# Altium project Laser-Cueing.PrjPcb
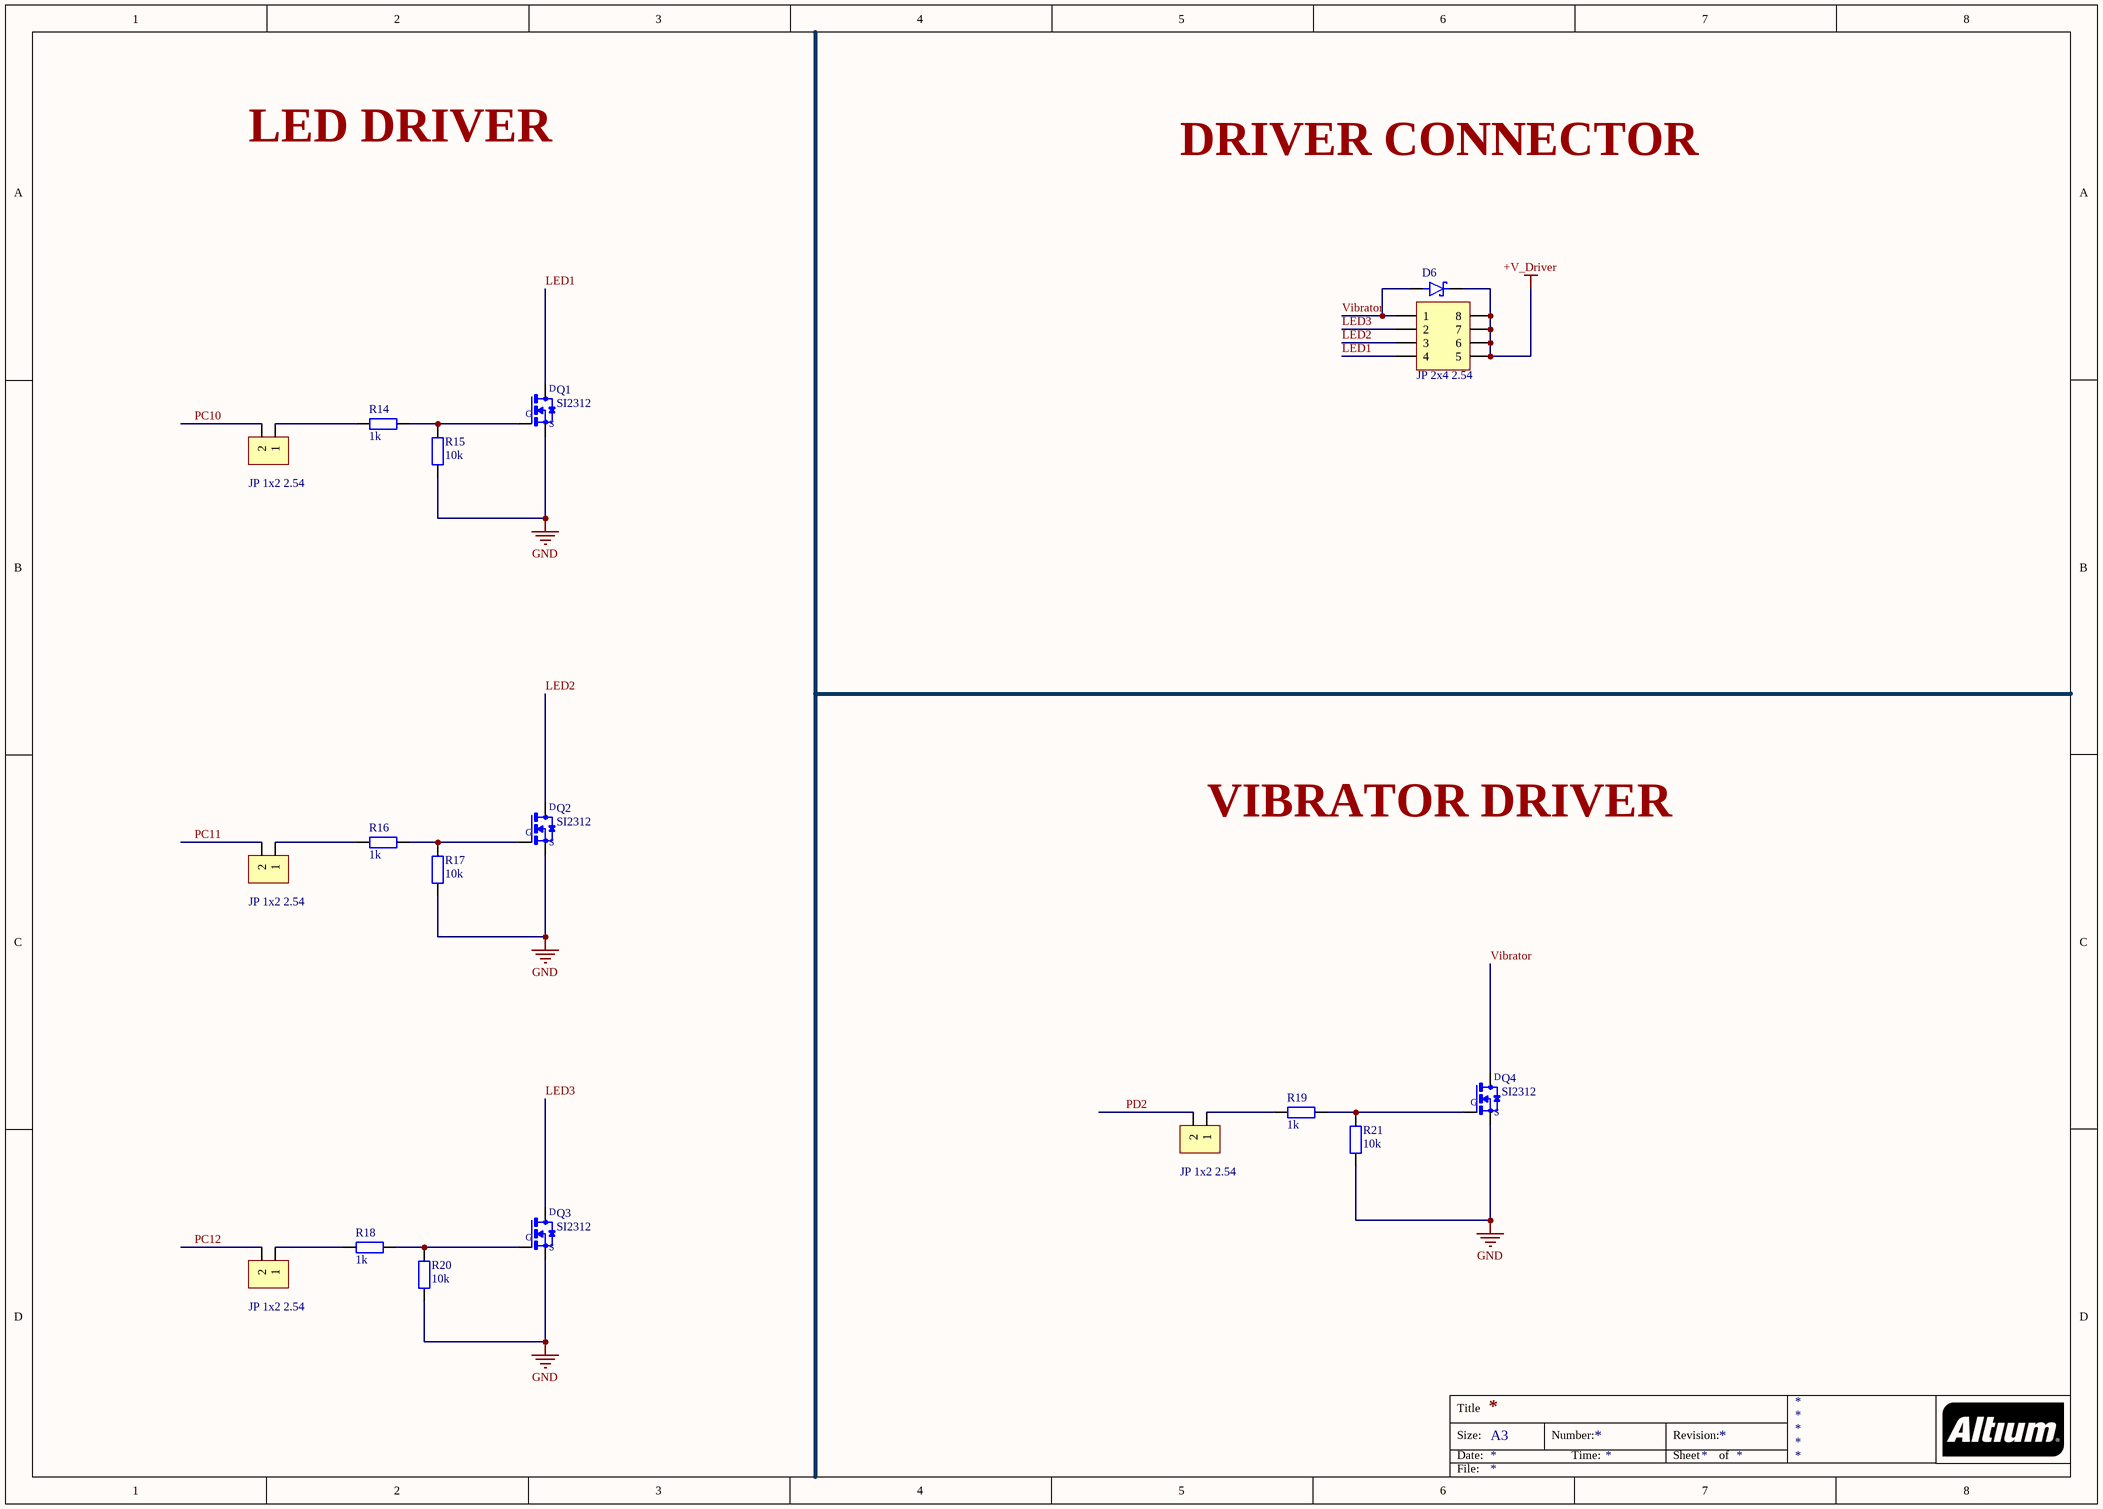
[diagram p0: Driver.SchDoc]
4 sheets, 89 parts. Net scope: global (net labels, ports and power ports of the same name join across sheets).
Board file: Cueing-PCB.PcbDoc
Sheets:
  Driver.SchDoc
  STM32_MCU.SchDoc
  ADC.SchDoc
  PWR_SRC.SchDoc

## Sheet Driver.SchDoc
size A3

### Parts
D6  1N5819HW-7-F  [SOD3715X145N]  (value not drawn)
Driver1  JP 2x4 2.54  [JP 2x4 DT]
JP2  JP 1x2 2.54  [JP 1x2 DT]
JP3  JP 1x2 2.54  [JP 1x2 DT]
JP4  JP 1x2 2.54  [JP 1x2 DT]
JP5  JP 1x2 2.54  [JP 1x2 DT]
Q1  SI2312  [SOT23]
Q2  SI2312  [SOT23]
Q3  SI2312  [SOT23]
Q4  SI2312  [SOT23]
R14  1k  [tro smd 0603]
R15  10k  [tro smd 0603]
R16  1k  [tro smd 0603]
R17  10k  [tro smd 0603]
R18  1k  [tro smd 0603]
R19  1k  [tro smd 0603]
R20  10k  [tro smd 0603]
R21  10k  [tro smd 0603]

### Nets
+V_Driver: D6.C(K) Driver1.5 Driver1.6 Driver1.7 Driver1.8
GND: Q1.2(S) Q2.2(S) Q3.2(S) Q4.2(S) R15.1 R17.1 R20.1 R21.1
LED1: Driver1.4 Q1.3(D)
LED2: Driver1.3 Q2.3(D)
LED3: Driver1.2 Q3.3(D)
PC10: JP2.2
PC11: JP3.2
PC12: JP4.2
PD2: JP5.2
Vibrator: D6.A Driver1.1 Q4.3(D)
NetJP2_1: JP2.1 R14.1
NetJP3_1: JP3.1 R16.1
NetJP4_1: JP4.1 R18.1
NetJP5_1: JP5.1 R19.1
NetQ1_1: Q1.1(G) R14.2 R15.2
NetQ2_1: Q2.1(G) R16.2 R17.2
NetQ3_1: Q3.1(G) R18.2 R20.2
NetQ4_1: Q4.1(G) R19.2 R21.2

### Notes on the sheet
- LED DRIVER
- DRIVER CONNECTOR
- VIBRATOR DRIVER
- Title
- Size:
- Date:
- A3
- Number:
- Time:
- Revision:
- Sheet
- of
- File:

### Library data of the parts
D6 = 1N5819HW-7-F: 1N5819HW Series 40 V 1 A Surface Mount Schottky Barrier Rectifier - SOD-123; MF: {'manufacturer': u'Diodes Inc.'}; Package: None; Price: None; Value: *; MP: 1N5819HW-7-F; Availability: Unavailable
Driver1 = JP 2x4 2.54 Duc Thang: Cắm; Ten_Linh_Kien: Jump Đôi Đực 2.54MM 2x40P Thẳng 11MM; Don_Vi: Con; Ma_Hang: MH002686; Ghi_Chu: *; Kieu_Chan: *; Chung_Loai: Cắm
JP2-JP5 = JP 1x2 2.54 Duc Thang: Cắm; Ten_Linh_Kien: Jump Đơn Đực 2.54MM 1x40P Thẳng 11MM; Don_Vi: Con; Ma_Hang: MH000903; Ghi_Chu: *; Kieu_Chan: *; Chung_Loai: Cắm
Q1-Q4 = SI2312: <b>N-Channel MOSFET</b>    <a href="https://pricing.snapeda.com/parts/SI2312/Micro%20Commercial%20Components/view-part?ref=eda">Check availability</a> <a href="https://pricing.snapeda.com/parts/SI2312/Micro%20Commercial%20Components/view-part?ref=eda">Check availability</a>; MF: {'manufacturer': u'Micro Commercial Components'}; MP: SI2312-TP; Package: None; Price: None; Value: *; Availability: Unavailable
R14 R16 R18 R19 = Tro 0603 1% 1k: Dán; So_Chan: 2; Don_Vi: Con; Ten_Linh_Kien: Trở 0603 1% 1k; Ma_Hang: MH006334; Chung_Loai: Dán; Kieu_Chan: *
R15 R17 R20 R21 = Tro 0603 1% 10k: Dán; Don_Vi: Con; So_Chan: 2; Ten_Linh_Kien: Trở 0603 1% 10k; Ma_Hang: MH006333; Chung_Loai: Dán; Kieu_Chan: *

## Sheet STM32_MCU.SchDoc
size A2
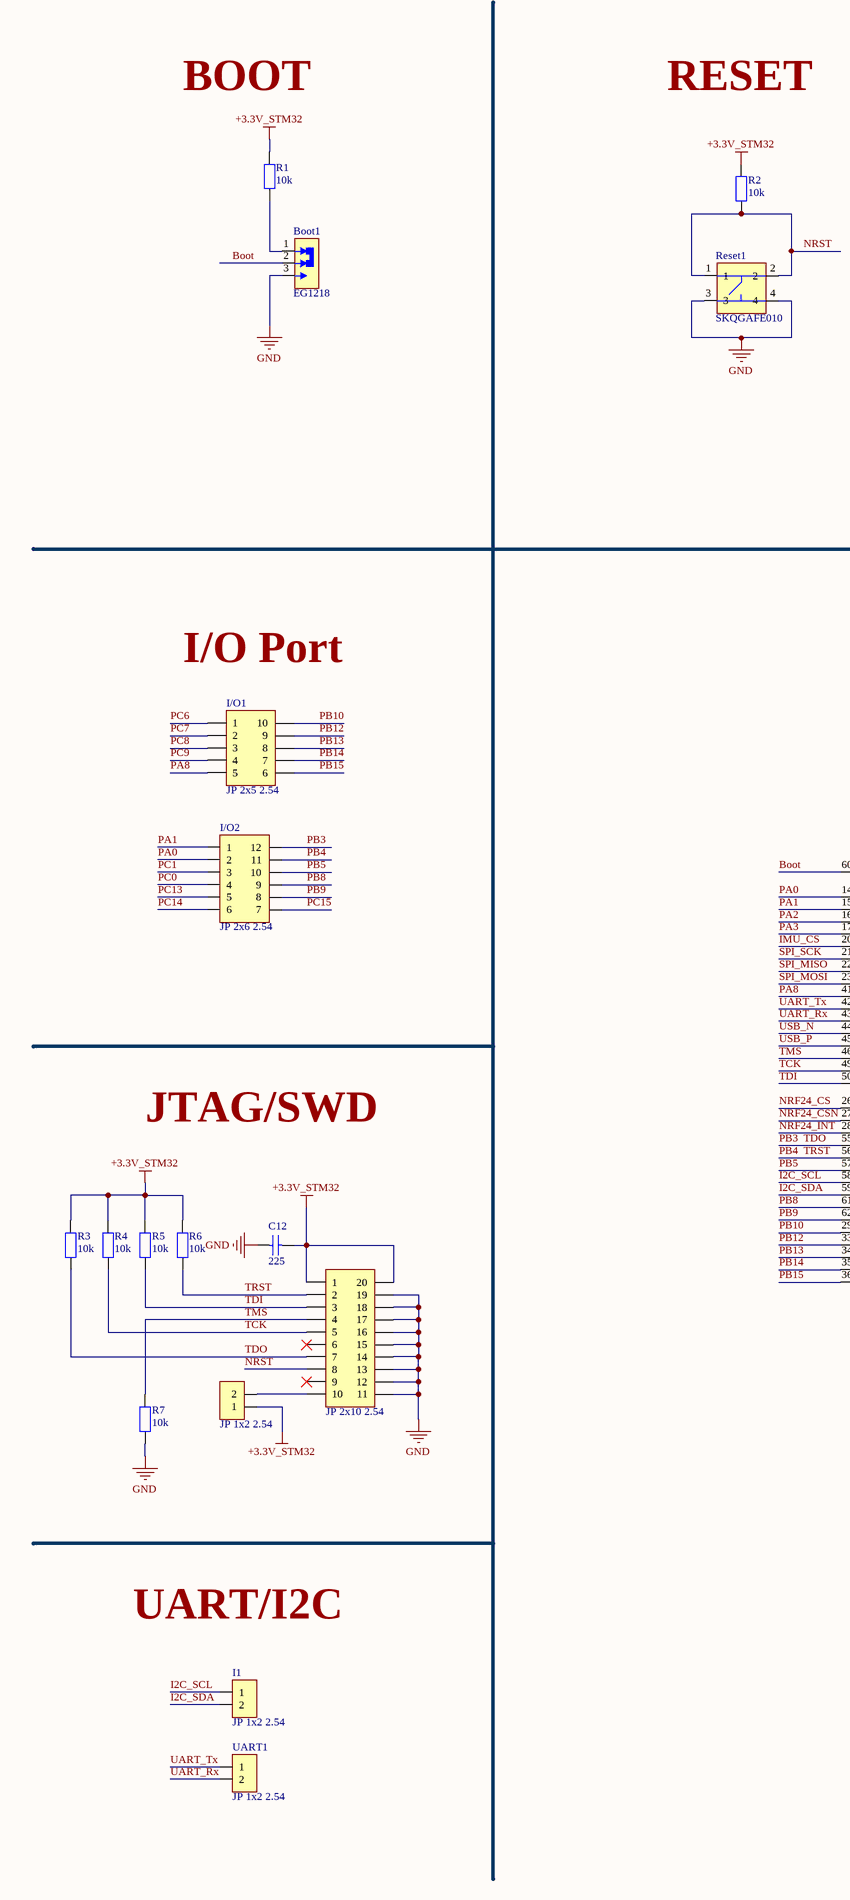
[diagram p1: STM32_MCU.SchDoc, left]
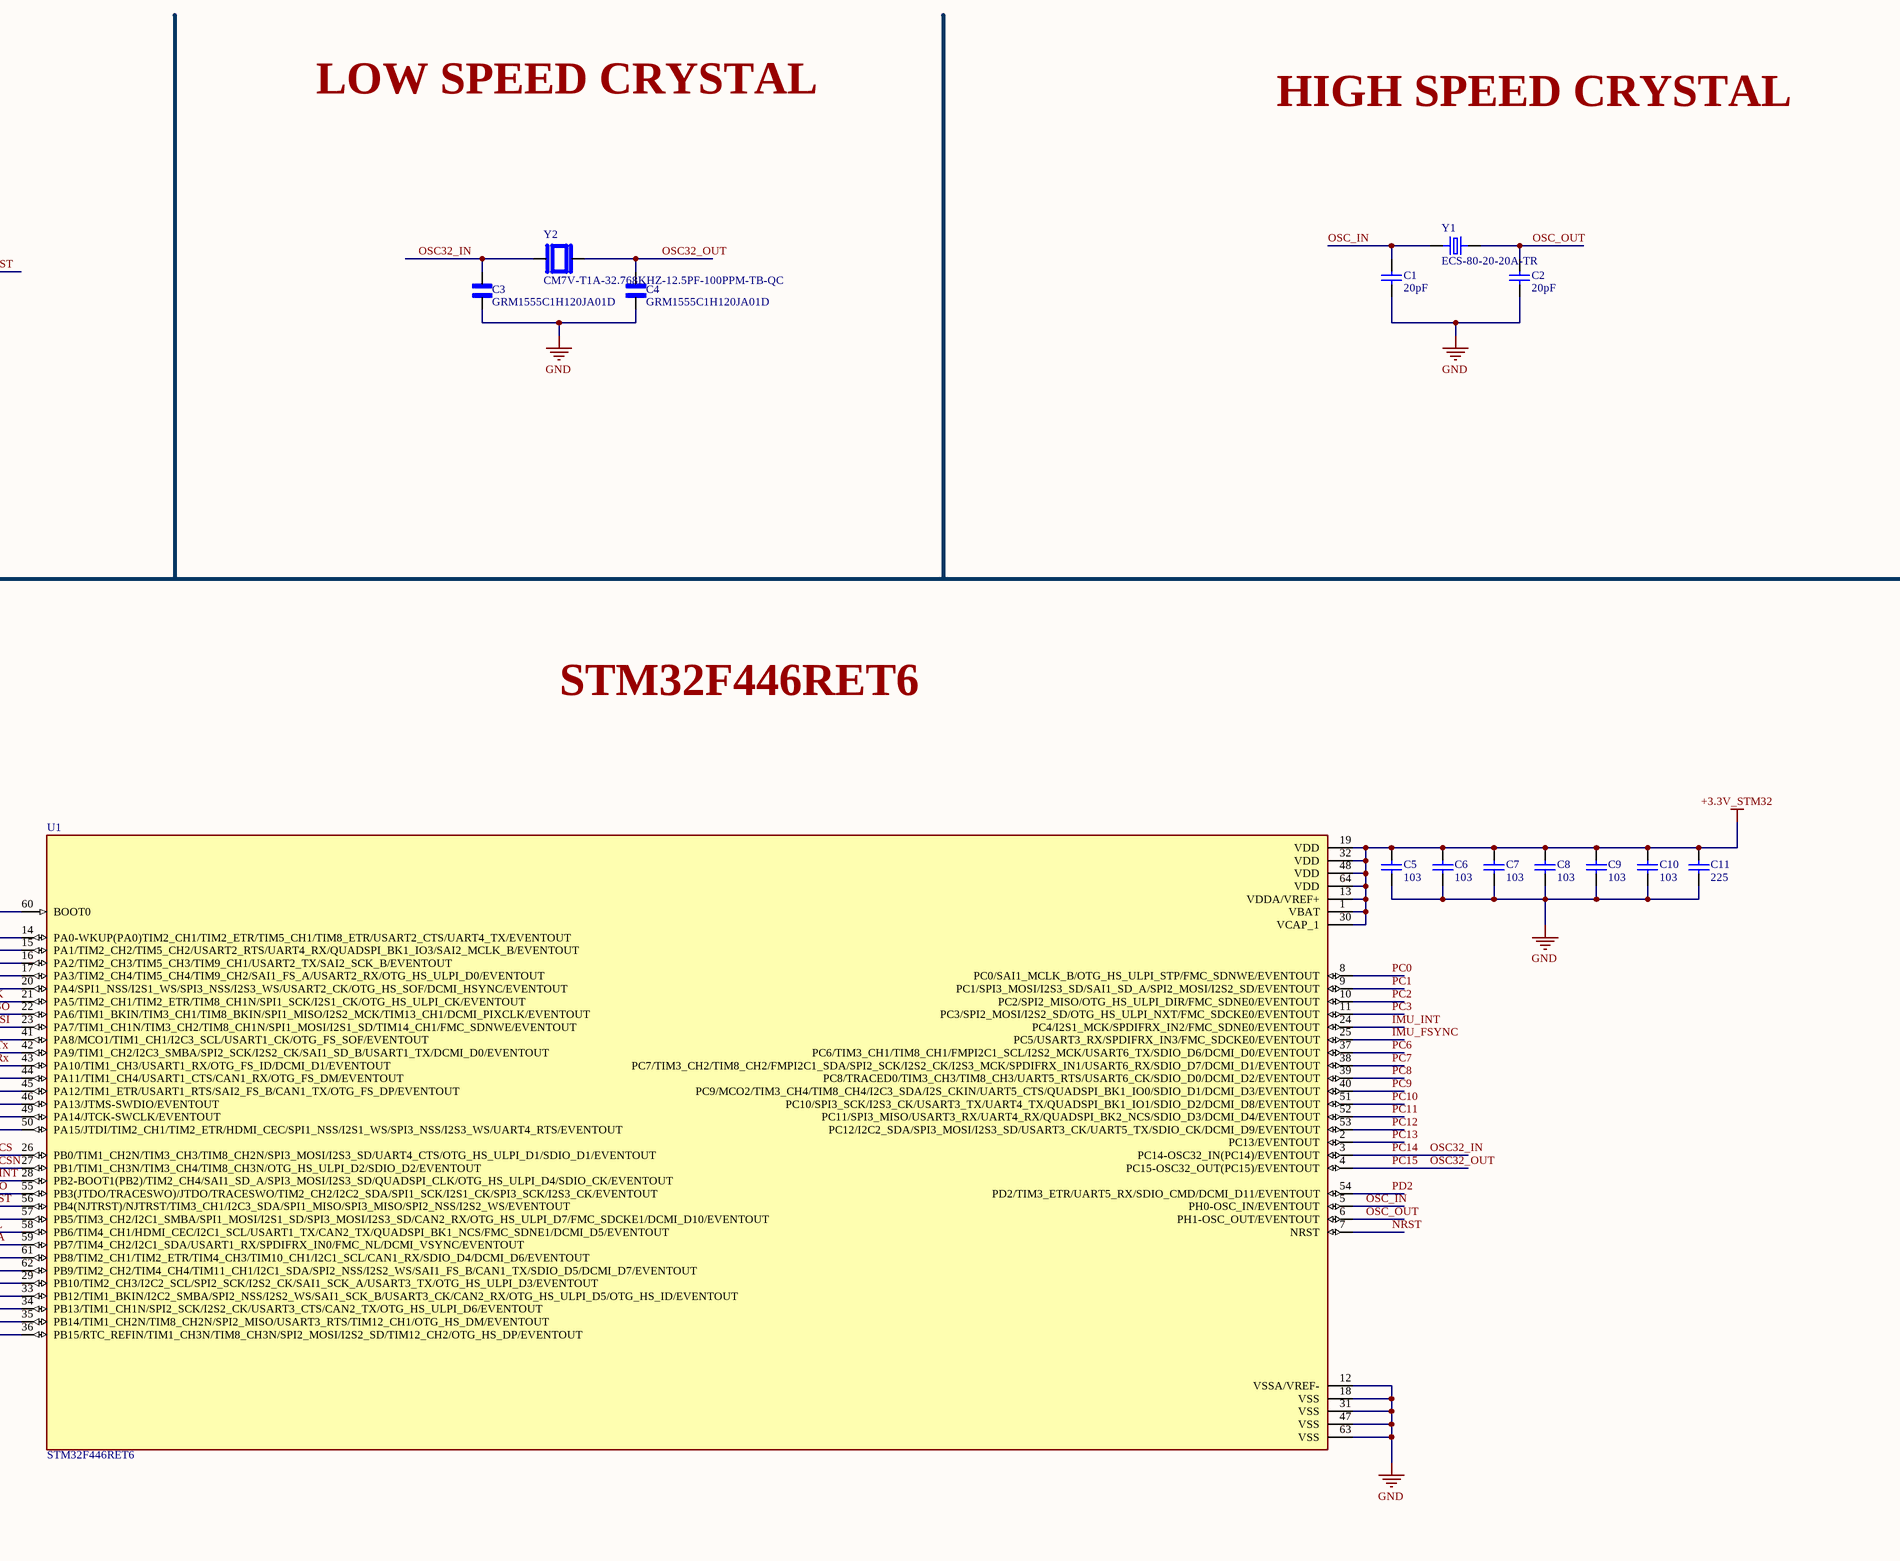
[diagram p2: STM32_MCU.SchDoc, right]

### Parts
Boot1  EG1218  [SW_EG1218]
C1  20pF  [tu 0805]
C2  20pF  [tu 0805]
C3  GRM1555C1H120JA01D  [CAPC1005X55N]
C4  GRM1555C1H120JA01D  [CAPC1005X55N]
C5  103  [tu 0603]
C6  103  [tu 0603]
C7  103  [tu 0603]
C8  103  [tu 0603]
C9  103  [tu 0603]
C10  103  [tu 0603]
C11  225  [tu 0805]
C12  225  [tu 0805]
I1  JP 1x2 2.54  [JP 1x2 DT]
I/O1  JP 2x5 2.54  [JP 2x5 DT]
I/O2  JP 2x6 2.54  [JP 2x6 DT]
JP1  JP 1x2 2.54  [JP 1x2 DT]
R1  10k  [tro smd 0603]
R2  10k  [tro smd 0603]
R3  10k  [tro smd 0603]
R4  10k  [tro smd 0603]
R5  10k  [tro smd 0603]
R6  10k  [tro smd 0603]
R7  10k  [tro smd 0603]
Reset1  SKQGAFE010  [SW_SKQGAFE010]
SWD/JTAG1  JP 2x10 2.54  [JP 2x10 DT]
U1  STM32F446RET6  [QFP50P1200X1200X160-64N]
UART1  JP 1x2 2.54  [JP 1x2 DT]
Y1  ECS-80-20-20A-TR  [XTAL_ECS-80-20-20A-TR]
Y2  CM7V-T1A-32.768KHZ-12.5PF-100PPM-TB-QC  [XTAL_CM7V-T1A-32.768KHZ-12.5PF-100PPM-TB-QC]

### Nets
+3.3V_STM32: C5.1 C6.1 C7.1 C8.1 C9.1 C10.1 C11.1 C12.1 JP1.1 R1.2 R2.2 R3.2 R4.2 R5.2 R6.2 SWD/JTAG1.1 SWD/JTAG1.20 U1.1(VBAT) U1.13(VDDA/VREF+) U1.19(VDD) U1.30(VCAP_1) U1.32(VDD) U1.48(VDD) U1.64(VDD)
GND: Boot1.3(NO) C1.2 C2.2 C3.1 C4.1 C5.2 C6.2 C7.2 C8.2 C9.2 C10.2 C11.2 C12.2 R7.1 Reset1.3 Reset1.4 SWD/JTAG1.11 SWD/JTAG1.12 SWD/JTAG1.13 SWD/JTAG1.14 SWD/JTAG1.15 SWD/JTAG1.16 SWD/JTAG1.17 SWD/JTAG1.18 SWD/JTAG1.19 U1.12(VSSA/VREF-) U1.18(VSS) U1.31(VSS) U1.47(VSS) U1.63(VSS)
Boot: Boot1.2(COM) U1.60(BOOT0)
I2C_SCL: I1.1 U1.58(PB6/TIM4_CH1/HDMI_CEC/I2C1_SCL/USART1_TX/CAN2_TX/QUADSPI_BK1_NCS/FMC_SDNE1/DCMI_D5/EVENTOUT)
I2C_SDA: I1.2 U1.59(PB7/TIM4_CH2/I2C1_SDA/USART1_RX/SPDIFRX_IN0/FMC_NL/DCMI_VSYNC/EVENTOUT)
IMU_CS: U1.20(PA4/SPI1_NSS/I2S1_WS/SPI3_NSS/I2S3_WS/USART2_CK/OTG_HS_SOF/DCMI_HSYNC/EVENTOUT)
IMU_FSYNC: U1.25(PC5/USART3_RX/SPDIFRX_IN3/FMC_SDCKE0/EVENTOUT)
IMU_INT: U1.24(PC4/I2S1_MCK/SPDIFRX_IN2/FMC_SDNE0/EVENTOUT)
NRF24_CS: U1.26(PB0/TIM1_CH2N/TIM3_CH3/TIM8_CH2N/SPI3_MOSI/I2S3_SD/UART4_CTS/OTG_HS_ULPI_D1/SDIO_D1/EVENTOUT)
NRF24_CSN: U1.27(PB1/TIM1_CH3N/TIM3_CH4/TIM8_CH3N/OTG_HS_ULPI_D2/SDIO_D2/EVENTOUT)
NRF24_INT: U1.28(PB2-BOOT1(PB2)/TIM2_CH4/SAI1_SD_A/SPI3_MOSI/I2S3_SD/QUADSPI_CLK/OTG_HS_ULPI_D4/SDIO_CK/EVENTOUT)
NRST: R2.1 Reset1.1 Reset1.2 SWD/JTAG1.8 U1.7(NRST)
OSC32_IN: C3.2 I/O2.6 U1.3(PC14-OSC32_IN(PC14)/EVENTOUT) Y2.1  [also labelled PC14]
OSC32_OUT: C4.2 I/O2.7 U1.4(PC15-OSC32_OUT(PC15)/EVENTOUT) Y2.2  [also labelled PC15]
OSC_IN: C1.1 U1.5(PH0-OSC_IN/EVENTOUT) Y1.1
OSC_OUT: C2.1 U1.6(PH1-OSC_OUT/EVENTOUT) Y1.2
PA0: I/O2.2 U1.14(PA0-WKUP(PA0)TIM2_CH1/TIM2_ETR/TIM5_CH1/TIM8_ETR/USART2_CTS/UART4_TX/EVENTOUT)
PA1: I/O2.1 U1.15(PA1/TIM2_CH2/TIM5_CH2/USART2_RTS/UART4_RX/QUADSPI_BK1_IO3/SAI2_MCLK_B/EVENTOUT)
PA2: U1.16(PA2/TIM2_CH3/TIM5_CH3/TIM9_CH1/USART2_TX/SAI2_SCK_B/EVENTOUT)
PA3: U1.17(PA3/TIM2_CH4/TIM5_CH4/TIM9_CH2/SAI1_FS_A/USART2_RX/OTG_HS_ULPI_D0/EVENTOUT)
PA8: I/O1.5 U1.41(PA8/MCO1/TIM1_CH1/I2C3_SCL/USART1_CK/OTG_FS_SOF/EVENTOUT)
PB3: I/O2.12 R3.1 SWD/JTAG1.7 U1.55(PB3(JTDO/TRACESWO)/JTDO/TRACESWO/TIM2_CH2/I2C2_SDA/SPI1_SCK/I2S1_CK/SPI3_SCK/I2S3_CK/EVENTOUT)  [also labelled TDO]
PB4: I/O2.11 R6.1 SWD/JTAG1.2 U1.56(PB4(NJTRST)/NJTRST/TIM3_CH1/I2C3_SDA/SPI1_MISO/SPI3_MISO/SPI2_NSS/I2S2_WS/EVENTOUT)  [also labelled TRST]
PB5: I/O2.10 U1.57(PB5/TIM3_CH2/I2C1_SMBA/SPI1_MOSI/I2S1_SD/SPI3_MOSI/I2S3_SD/CAN2_RX/OTG_HS_ULPI_D7/FMC_SDCKE1/DCMI_D10/EVENTOUT)
PB8: I/O2.9 U1.61(PB8/TIM2_CH1/TIM2_ETR/TIM4_CH3/TIM10_CH1/I2C1_SCL/CAN1_RX/SDIO_D4/DCMI_D6/EVENTOUT)
PB9: I/O2.8 U1.62(PB9/TIM2_CH2/TIM4_CH4/TIM11_CH1/I2C1_SDA/SPI2_NSS/I2S2_WS/SAI1_FS_B/CAN1_TX/SDIO_D5/DCMI_D7/EVENTOUT)
PB10: I/O1.10 U1.29(PB10/TIM2_CH3/I2C2_SCL/SPI2_SCK/I2S2_CK/SAI1_SCK_A/USART3_TX/OTG_HS_ULPI_D3/EVENTOUT)
PB12: I/O1.9 U1.33(PB12/TIM1_BKIN/I2C2_SMBA/SPI2_NSS/I2S2_WS/SAI1_SCK_B/USART3_CK/CAN2_RX/OTG_HS_ULPI_D5/OTG_HS_ID/EVENTOUT)
PB13: I/O1.8 U1.34(PB13/TIM1_CH1N/SPI2_SCK/I2S2_CK/USART3_CTS/CAN2_TX/OTG_HS_ULPI_D6/EVENTOUT)
PB14: I/O1.7 U1.35(PB14/TIM1_CH2N/TIM8_CH2N/SPI2_MISO/USART3_RTS/TIM12_CH1/OTG_HS_DM/EVENTOUT)
PB15: I/O1.6 U1.36(PB15/RTC_REFIN/TIM1_CH3N/TIM8_CH3N/SPI2_MOSI/I2S2_SD/TIM12_CH2/OTG_HS_DP/EVENTOUT)
PC0: I/O2.4 U1.8(PC0/SAI1_MCLK_B/OTG_HS_ULPI_STP/FMC_SDNWE/EVENTOUT)
PC1: I/O2.3 U1.9(PC1/SPI3_MOSI/I2S3_SD/SAI1_SD_A/SPI2_MOSI/I2S2_SD/EVENTOUT)
PC2: U1.10(PC2/SPI2_MISO/OTG_HS_ULPI_DIR/FMC_SDNE0/EVENTOUT)
PC3: U1.11(PC3/SPI2_MOSI/I2S2_SD/OTG_HS_ULPI_NXT/FMC_SDCKE0/EVENTOUT)
PC6: I/O1.1 U1.37(PC6/TIM3_CH1/TIM8_CH1/FMPI2C1_SCL/I2S2_MCK/USART6_TX/SDIO_D6/DCMI_D0/EVENTOUT)
PC7: I/O1.2 U1.38(PC7/TIM3_CH2/TIM8_CH2/FMPI2C1_SDA/SPI2_SCK/I2S2_CK/I2S3_MCK/SPDIFRX_IN1/USART6_RX/SDIO_D7/DCMI_D1/EVENTOUT)
PC8: I/O1.3 U1.39(PC8/TRACED0/TIM3_CH3/TIM8_CH3/UART5_RTS/USART6_CK/SDIO_D0/DCMI_D2/EVENTOUT)
PC9: I/O1.4 U1.40(PC9/MCO2/TIM3_CH4/TIM8_CH4/I2C3_SDA/I2S_CKIN/UART5_CTS/QUADSPI_BK1_IO0/SDIO_D1/DCMI_D3/EVENTOUT)
PC10: U1.51(PC10/SPI3_SCK/I2S3_CK/USART3_TX/UART4_TX/QUADSPI_BK1_IO1/SDIO_D2/DCMI_D8/EVENTOUT)
PC11: U1.52(PC11/SPI3_MISO/USART3_RX/UART4_RX/QUADSPI_BK2_NCS/SDIO_D3/DCMI_D4/EVENTOUT)
PC12: U1.53(PC12/I2C2_SDA/SPI3_MOSI/I2S3_SD/USART3_CK/UART5_TX/SDIO_CK/DCMI_D9/EVENTOUT)
PC13: I/O2.5 U1.2(PC13/EVENTOUT)
PD2: U1.54(PD2/TIM3_ETR/UART5_RX/SDIO_CMD/DCMI_D11/EVENTOUT)
SPI_MISO: U1.22(PA6/TIM1_BKIN/TIM3_CH1/TIM8_BKIN/SPI1_MISO/I2S2_MCK/TIM13_CH1/DCMI_PIXCLK/EVENTOUT)
SPI_MOSI: U1.23(PA7/TIM1_CH1N/TIM3_CH2/TIM8_CH1N/SPI1_MOSI/I2S1_SD/TIM14_CH1/FMC_SDNWE/EVENTOUT)
SPI_SCK: U1.21(PA5/TIM2_CH1/TIM2_ETR/TIM8_CH1N/SPI1_SCK/I2S1_CK/OTG_HS_ULPI_CK/EVENTOUT)
TCK: R4.1 SWD/JTAG1.5 U1.49(PA14/JTCK-SWCLK/EVENTOUT)
TDI: R5.1 SWD/JTAG1.3 U1.50(PA15/JTDI/TIM2_CH1/TIM2_ETR/HDMI_CEC/SPI1_NSS/I2S1_WS/SPI3_NSS/I2S3_WS/UART4_RTS/EVENTOUT)
TMS: R7.2 SWD/JTAG1.4 U1.46(PA13/JTMS-SWDIO/EVENTOUT)
UART_Rx: U1.43(PA10/TIM1_CH3/USART1_RX/OTG_FS_ID/DCMI_D1/EVENTOUT) UART1.2
UART_Tx: U1.42(PA9/TIM1_CH2/I2C3_SMBA/SPI2_SCK/I2S2_CK/SAI1_SD_B/USART1_TX/DCMI_D0/EVENTOUT) UART1.1
USB_N: U1.44(PA11/TIM1_CH4/USART1_CTS/CAN1_RX/OTG_FS_DM/EVENTOUT)
USB_P: U1.45(PA12/TIM1_ETR/USART1_RTS/SAI2_FS_B/CAN1_TX/OTG_FS_DP/EVENTOUT)
NetBoot1_1: Boot1.1(NC) R1.1
NetJP1_2: JP1.2 SWD/JTAG1.10

Not connected (* = marked no-connect by the designer): SWD/JTAG1 6* 9*

### Notes on the sheet
- BOOT
- RESET
- LOW SPEED CRYSTAL
- HIGH SPEED CRYSTAL
- I/O Port
- STM32F446RET6
- JTAG/SWD
- UART/I2C
- Title
- Size:
- Date:
- File:
- A2
- Number:
- Time:
- Revision:
- Sheet
- of

### Library data of the parts
Boot1 = EG1218: Slide Switch, EG Series, SPDT, Non-Shorting, ON-ON, 200mA DC, 30VDC, PC Pin | E-Switch EG1218; SnapEDA_Link: https://www.snapeda.com/parts/EG1218/E-Switch/view-part/?ref=snap; Package: None; Value: *; MF: E-Switch; MP: EG1218; Check_prices: https://www.snapeda.com/parts/EG1218/E-Switch/view-part/?ref=eda
C1 C2 = Tu 0805 20pF 50V 10%: Dán; Don_Vi: Con; Ten_Linh_Kien: Tụ 0805 20P 10% 50V; So_Chan: 2; Ma_Hang: MH004558; Chung_Loai: Dán; Kieu_Chan: *
C3 C4 = GRM1555C1H120JA01D: 0402 12 pF 50 V Â±5% Tolerance C0G SMT Multilayer Ceramic Capacitor; MF: {'manufacturer': u'Murata'}; Package: None; Price: None; Value: *; MP: GRM1555C1H120JA01D; Availability: Unavailable
C5-C10 = Tu 0603 103 50V 10%: Dán; Don_Vi: Con; So_Chan: 2; Ten_Linh_Kien: Tụ 0603 103-10nF 10% 50V; Ma_Hang: MH004567; Chung_Loai: Dán; Kieu_Chan: *
C11 C12 = Tu 0805 225 25V 10%: Dán; Don_Vi: Con; So_Chan: 2; Ten_Linh_Kien: Tụ 0805 225-2.2uF 25V 10%; Ma_Hang: MH007483; Chung_Loai: Dán; Kieu_Chan: *
I1 JP1 UART1 = JP 1x2 2.54 Duc Thang: as JP2 on sheet Driver; Ghi_Chu: *; Kieu_Chan: *; Chung_Loai: Cắm
I/O1 = JP 2x5 2.54 Duc Thang: Cắm; Ten_Linh_Kien: Jump Đôi Đực 2.54MM 2x40P Thẳng 11MM; Don_Vi: Con; Ma_Hang: MH002686; Ghi_Chu: *; Kieu_Chan: *; Chung_Loai: Cắm
I/O2 = JP 2x6 2.54 Duc Thang: Cắm; Ten_Linh_Kien: Jump Đôi Đực 2.54MM 2x40P Thẳng 11MM; Don_Vi: Con; Ma_Hang: MH002686; Ghi_Chu: *; Kieu_Chan: *; Chung_Loai: Cắm
R1-R7 = Tro 0603 1% 10k: as R15 on sheet Driver; Chung_Loai: Dán; Kieu_Chan: *
Reset1 = SKQGAFE010: Switch Tactile N.O. SPST Button Gull Wing 0.05A 12VDC 0.98N SMD T/R; MF: {'manufacturer': u'ALPS'}; Package: None; Price: None; Value: *; MP: SKQGAFE010; Availability: Unavailable
SWD/JTAG1 = JP 2x10 2.54 Duc Thang: Cắm; Ten_Linh_Kien: Jump Đôi Đực 2.54MM 2x40P Thẳng 11MM; Don_Vi: Con; Ma_Hang: MH002686; Ghi_Chu: *; Kieu_Chan: *; Chung_Loai: Cắm
U1 = STM32F446RET6: MCU 32-Bit STM32 ARM Cortex M4 RISC 512KB Flash 2.5V/3.3V 64-Pin LQFP Tray; MF: {'manufacturer': u'STMicroelectronics'}; Package: None; Price: None; Value: *; MP: STM32F446RET6; Availability: Unavailable
Y1 = ECS-80-20-20A-TR: SMD CRYSTAL; MF: {'manufacturer': u'ECS Inc.'}; Package: None; Price: None; Value: *; MP: ECS-80-20-20A-TR; Availability: Unavailable
Y2 = CM7V-T1A-32.768KHZ-12.5PF-100PPM-TB-QC: MF: {'manufacturer': u'Micro Crystal'}; Package: None; Price: None; Value: *; MP: CM7V-T1A-32.768KHZ-12.5PF-100PPM-TB-QC; Availability: Unavailable

## Sheet ADC.SchDoc
size A4
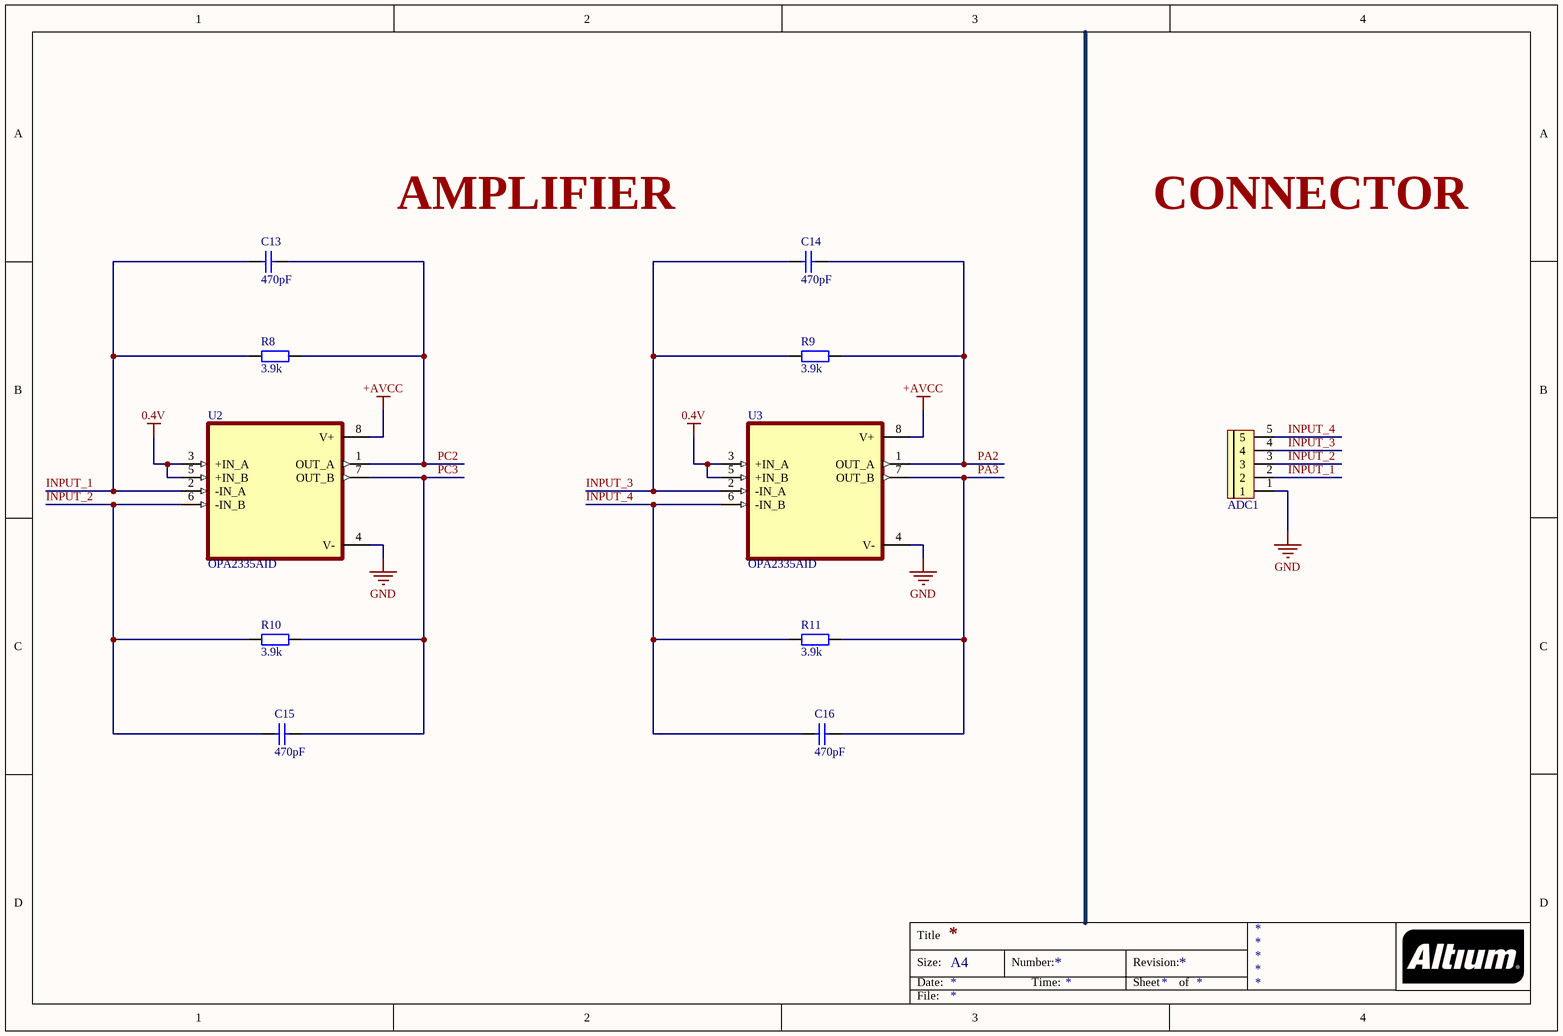
[diagram p3: ADC.SchDoc]

### Parts
ADC1  CON 5 EDG5.08  [CON 5 5EDG5.08]  (value not drawn)
C13  470pF  [tu 0603]
C14  470pF  [tu 0603]
C15  470pF  [tu 0603]
C16  470pF  [tu 0603]
R8  3.9k  [tro smd 0603]
R9  3.9k  [tro smd 0603]
R10  3.9k  [tro smd 0603]
R11  3.9k  [tro smd 0603]
U2  OPA2335AID  [SOIC127P599X175-8N]
U3  OPA2335AID  [SOIC127P599X175-8N]

### Nets
0.4V: U2.3(+IN_A) U2.5(+IN_B) U3.3(+IN_A) U3.5(+IN_B)
+AVCC: U2.8(V+) U3.8(V+)
GND: ADC1.1 U2.4(V-) U3.4(V-)
INPUT_1: ADC1.2 C13.2 R8.1 U2.2(-IN_A)
INPUT_2: ADC1.3 C15.2 R10.1 U2.6(-IN_B)
INPUT_3: ADC1.4 C14.2 R9.1 U3.2(-IN_A)
INPUT_4: ADC1.5 C16.2 R11.1 U3.6(-IN_B)
PA2: C14.1 R9.2 U3.1(OUT_A)
PA3: C16.1 R11.2 U3.7(OUT_B)
PC2: C13.1 R8.2 U2.1(OUT_A)
PC3: C15.1 R10.2 U2.7(OUT_B)

### Notes on the sheet
- AMPLIFIER
- CONNECTOR
- Title
- Size:
- Date:
- A4
- Number:
- Time:
- Revision:
- Sheet
- of
- File:

### Library data of the parts
ADC1 = CON 5 EDG5.08: Cắm; Ten_Linh_Kien: CON 5 2EDG5.08-5P 5.08MM ( Xanh Cong); Ma_Hang: MH003589; Kieu_Chan: *; Don_Vi: Con; Ghi_Chu: *; Chung_Loai: Cắm
C13-C16 = Tu 0603 470pF 50V 10%: Dán; Don_Vi: Con; So_Chan: 2; Ten_Linh_Kien: Tụ 0603 470P 50V 10%; Ma_Hang: MH004571; Chung_Loai: Dán; Kieu_Chan: *
R8-R11 = Tro 0603 1% 3.9k: Dán; So_Chan: 2; Ten_Linh_Kien: Trở 0603 1% 3.9k; Ma_Hang: MH005793; Don_Vi: Con; Chung_Loai: Dán; Kieu_Chan: *
U2 U3 = OPA2335AID: MF: {'manufacturer': u'Texas Instruments'}; Package: None; Price: None; Value: *; MP: OPA2335AID; Availability: Unavailable

## Sheet PWR_SRC.SchDoc
size A3
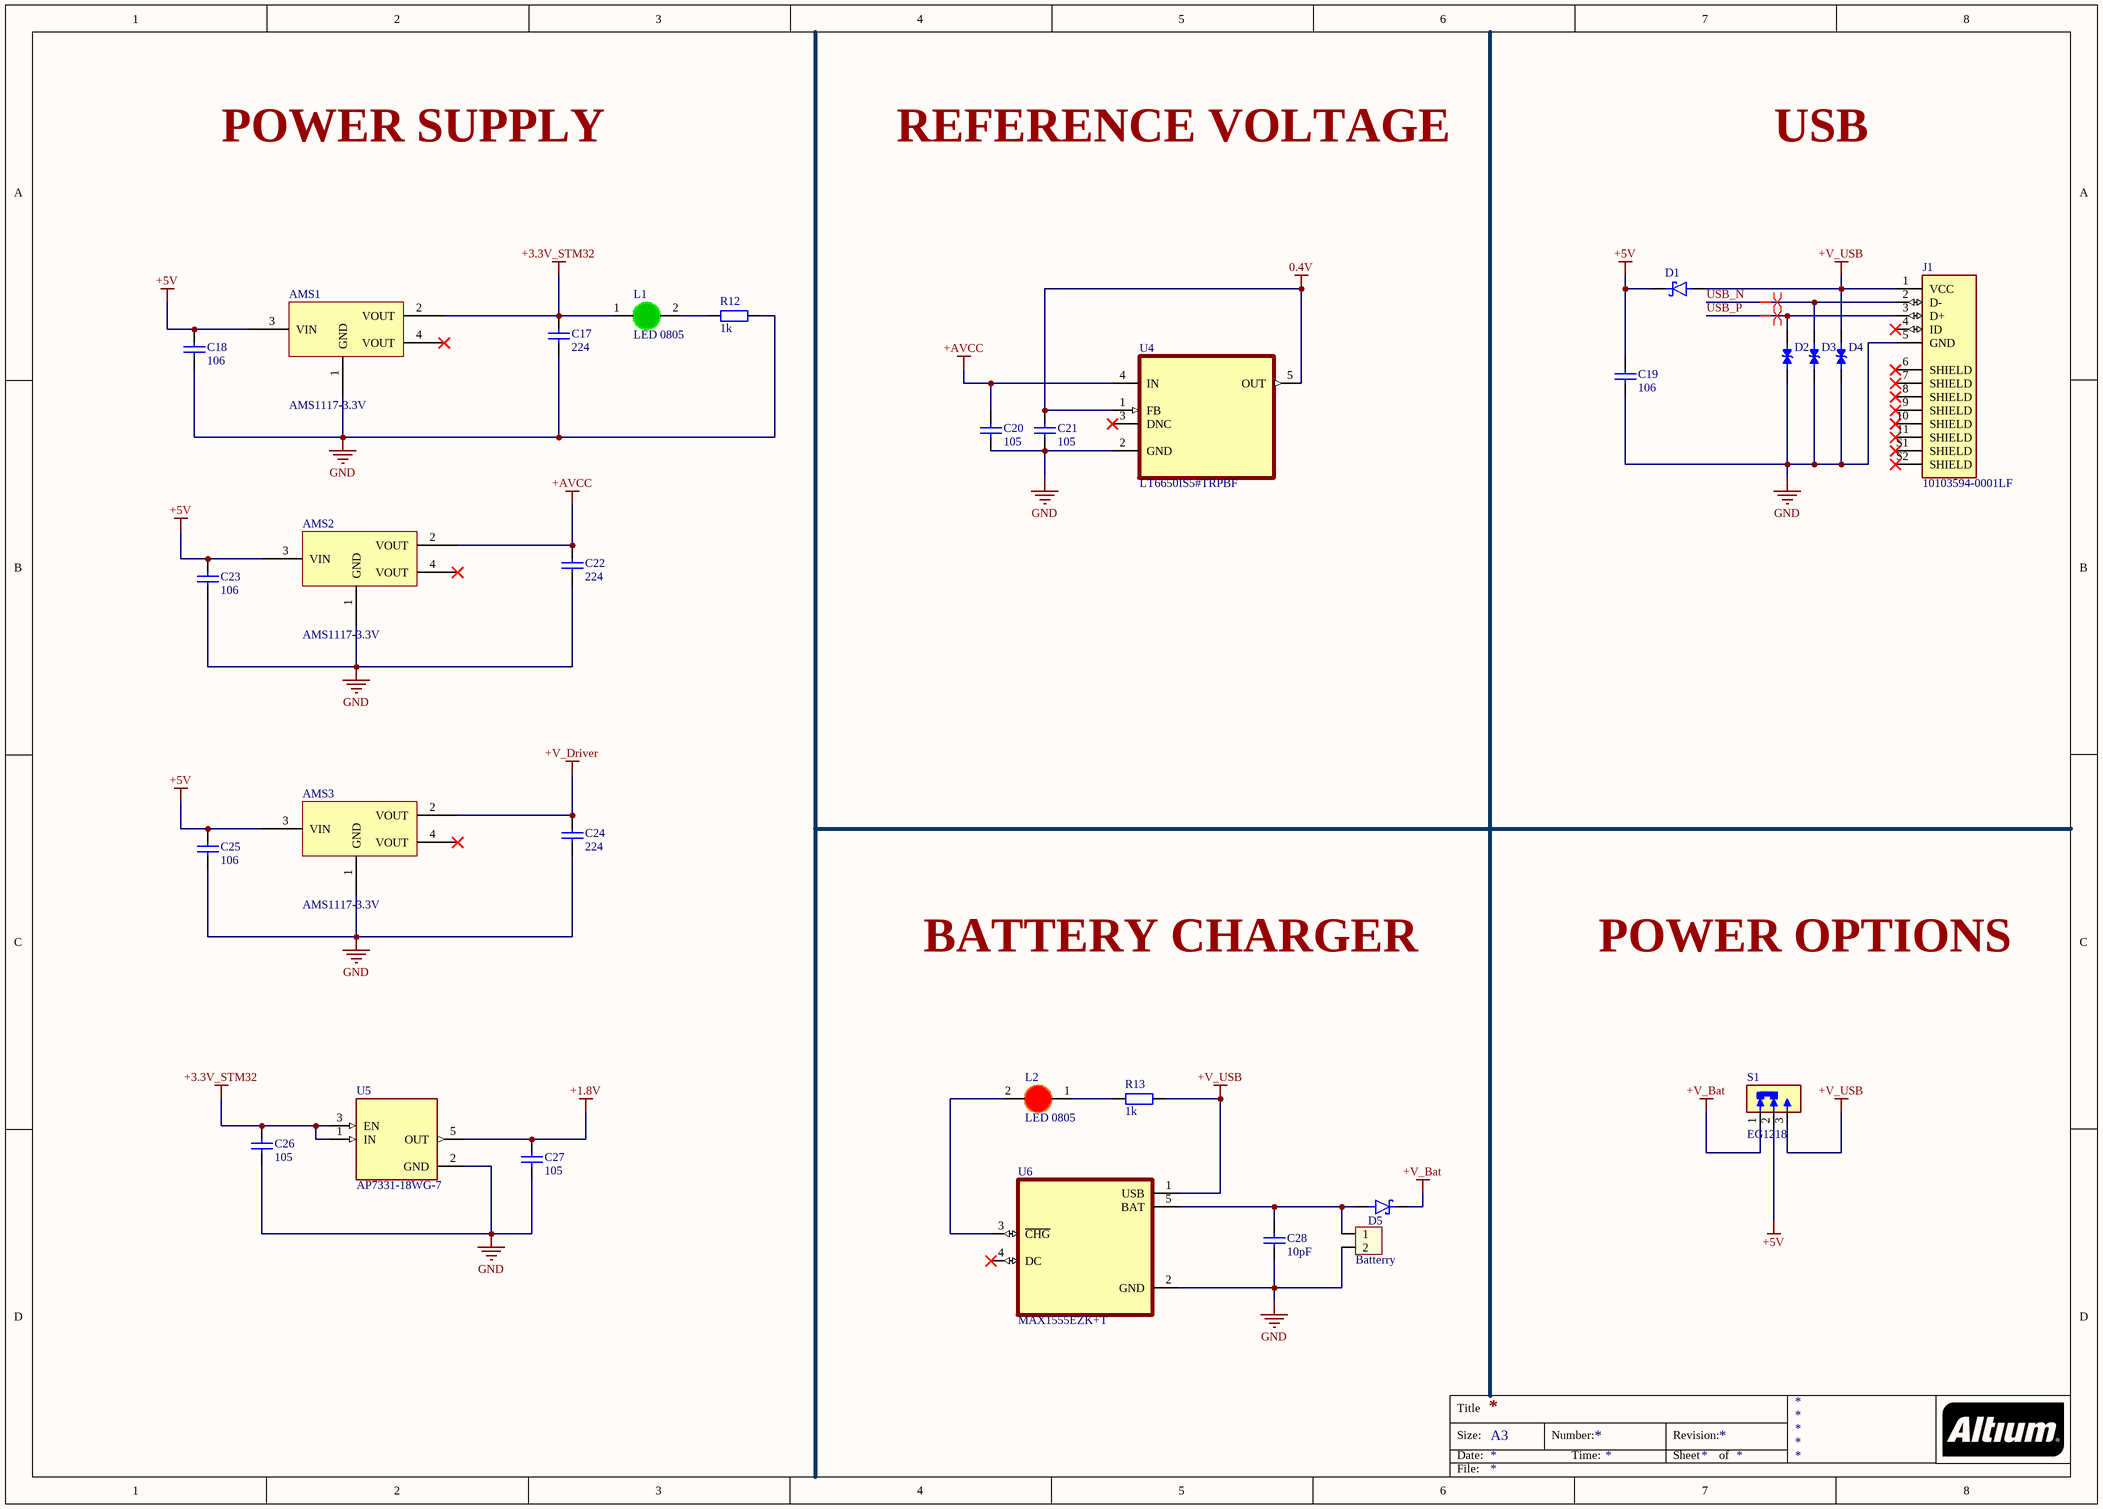
[diagram p4: PWR_SRC.SchDoc]

### Parts
AMS1  AMS1117-3.3V  [SOT223]
AMS2  AMS1117-3.3V  [SOT223]
AMS3  AMS1117-3.3V  [SOT223]
Batterry1  Batterry  [XH2.54M-2]
C17  224  [tu 0805]
C18  106  [tu 0603]
C19  106  [tu 0603]
C20  105  [tu 0603]
C21  105  [tu 0603]
C22  224  [tu 0805]
C23  106  [tu 0603]
C24  224  [tu 0805]
C25  106  [tu 0603]
C26  105  [tu 0603]
C27  105  [tu 0603]
C28  10pF  [tu 0805]
D1  1N5819HW-7-F  [SOD3715X145N]  (value not drawn)
D2  LESD5D5.0CT1G  [TVS_LESD5D5.0CT1G]  (value not drawn)
D3  LESD5D5.0CT1G  [TVS_LESD5D5.0CT1G]  (value not drawn)
D4  LESD5D5.0CT1G  [TVS_LESD5D5.0CT1G]  (value not drawn)
D5  1N5819HW-7-F  [SOD3715X145N]  (value not drawn)
J1  10103594-0001LF  [AMPHENOL_10103594-0001LF]
L1  LED 0805  [LED-0805-Green]
L2  LED 0805  [LED-0805-Red]
R12  1k  [tro smd 0603]
R13  1k  [tro smd 0603]
S1  EG1218  [SW_EG1218]
U4  LT6650IS5#TRPBF  [SOT95P280X100-5N]
U5  AP7331-18WG-7  [SOT95P285X145-5N]
U6  MAX1555EZK+T  [SOT95P275X110-5N]

### Nets
0.4V: C21.1 U4.1(FB) U4.5(OUT)
+1.8V: C27.1 U5.5(OUT)
+3.3V_STM32: AMS1.2(VOUT) C17.1 C26.1 L1.1(A) U5.1(IN) U5.3(EN)
+5V: AMS1.3(VIN) AMS2.3(VIN) AMS3.3(VIN) C18.1 C19.1 C23.1 C25.1 D1.C(K) S1.2(COM)
+AVCC: AMS2.2(VOUT) C20.1 C22.1 U4.4(IN)
+V_Bat: D5.C(K) S1.1(NC)
+V_Driver: AMS3.2(VOUT) C24.1
+V_USB: D1.A D4.2 J1.1(VCC) R13.2 S1.3(NO) U6.1(USB)
GND: AMS1.1(GND) AMS2.1(GND) AMS3.1(GND) Batterry1.2 C17.2 C18.2 C19.2 C20.2 C21.2 C22.2 C23.2 C24.2 C25.2 C26.2 C27.2 C28.2 D2.1 D3.1 D4.1 J1.5(GND) R12.2 U4.2(GND) U5.2(GND) U6.2(GND)
USB_N: D3.2 J1.2(D-)
USB_P: D2.2 J1.3(D+)
NetBatterry1_1: Batterry1.1 C28.1 D5.A U6.5(BAT)
NetL1_2: L1.2(K) R12.1
NetL2_1: L2.1(A) R13.1
NetL2_2: L2.2(K) U6.3(~{CHG})

Not connected (* = marked no-connect by the designer): AMS1 4(VOUT)*; AMS2 4(VOUT)*; AMS3 4(VOUT)*; J1 4(ID)* 6(SHIELD)* 7(SHIELD)* 8(SHIELD)* 9(SHIELD)* 10(SHIELD)* 11(SHIELD)* S1(SHIELD)* S2(SHIELD)*; U4 3(DNC)*; U6 4(DC)*

### Layout directives
differential pair; differential pair class diff90: USB_N, USB_P

### Notes on the sheet
- POWER SUPPLY
- REFERENCE VOLTAGE
- USB
- BATTERY CHARGER
- POWER OPTIONS
- Title
- Size:
- Date:
- A3
- Number:
- Time:
- Revision:
- Sheet
- of
- File:

### Library data of the parts
AMS1-AMS3 = AMS1117 SMD: Dán; Value: AMS1117-3.3V SOT223; Don_Vi: Con; Ma_Hang: MH000596; Ghi_Chu: *; Kieu_Chan: *; Chung_Loai: Dán
Batterry1 = Header 2P 2.54 Duc Thang: Cắm; Ten_Linh_Kien: Header 2P XH2.54-2P Đực Thẳng; Don_Vi: Con; Ma_Hang: MH001283; Chung_Loai: Cắm
C17 C22 C24 = Tu 0805 224 50V 10%: Dán; Don_Vi: Con; So_Chan: 2; Ten_Linh_Kien: Tụ 0805 224-0.22uF 10% 50V; Ma_Hang: MH004559; Chung_Loai: Dán; Kieu_Chan: *
C18 C19 C23 C25 = Tu 0603 106 16V 20%: Dán; Don_Vi: Con; So_Chan: 2; Ten_Linh_Kien: Tụ 0603-10uF 20% 16V; Ma_Hang: MH004848; Chung_Loai: Dán; Kieu_Chan: *
C20 C21 C26 C27 = Tu 0603 105 16V 20%: Dán; Don_Vi: Con; So_Chan: 2; Ten_Linh_Kien: Tụ 0603 105-1uF 20% 16V; Ma_Hang: MH004574; Chung_Loai: Dán; Kieu_Chan: *
C28 = Tu 0805 10pF 50V 10%: Dán; Don_Vi: Con; So_Chan: 2; Ten_Linh_Kien: Tụ 0805 10P 10% 50V; Ma_Hang: MH004554; Chung_Loai: Dán; Kieu_Chan: *
D1 D5 = 1N5819HW-7-F: as D6 on sheet Driver; Package: None; Price: None; Value: *; MP: 1N5819HW-7-F; Availability: Unavailable
D2-D4 = LESD5D5.0CT1G: MF: {'manufacturer': u'Leshan Radio Co.'}; Package: None; Price: None; Value: *; MP: LESD5D5.0CT1G; Availability: Unavailable
J1 = 10103594-0001LF: USB - micro B USB 2.0 Receptacle Connector 5 Position Surface Mount, Right Angle; Through Hole; MF: {'manufacturer': u'FCI Connectors'}; Package: None; Price: None; Value: *; MP: 10103594-0001LF; Availability: Unavailable
L1 = LED 0805 Xanh La: Dán; Don_Vi: Con; Ma_Hang: MH002326; Ten_Linh_Kien: LED 0805 Màu Xanh Lá (Green); Ghi_Chu: *; Kieu_Chan: *; Chung_Loai: Dán
L2 = LED 0805 Do: Dán; Don_Vi: Con; Ma_Hang: MH000897; Ten_Linh_Kien: LED 0805 Màu Đỏ (Red); Ghi_Chu: *; Kieu_Chan: *; Chung_Loai: Dán
R12 = Tro 0603 5% 1k: Dán; Don_Vi: Con; So_Chan: 2; Ten_Linh_Kien: Trở 0603 5% 1k; Ma_Hang: MH006319; Chung_Loai: Dán; Kieu_Chan: *
R13 = Tro 0603 1% 1k: as R14 on sheet Driver; Chung_Loai: Dán; Kieu_Chan: *
S1 = EG1218: as Boot1 on sheet STM32_MCU; SnapEDA_Link: https://www.snapeda.com/parts/EG1218/E-Switch/view-part/?ref=snap; Package: None; Value: *; MF: E-Switch; MP: EG1218; Check_prices: https://www.snapeda.com/parts/EG1218/E-Switch/view-part/?ref=eda
U4 = LT6650IS5#TRPBF: Micropower, 400mV Reference with Rail-to-Rail Buffer Amplifier; MF: {'manufacturer': u'Analog Devices'}; Package: None; Price: None; Value: *; MP: LT6650IS5#TRPBF; Availability: Unavailable
U5 = AP7331-18WG-7: LDO Regulator Pos 1.8V 0.3A 5-Pin SOT-25 T/R; MF: {'manufacturer': u'Diodes Inc.'}; Package: None; Price: None; Value: *; MP: AP7331-18WG-7; Availability: Unavailable
U6 = MAX1555EZK+T: MF: {'manufacturer': u'Analog Devices'}; Package: None; Price: None; Value: *; MP: MAX1555EZK+; Availability: Unavailable

## Nets that join several sheets
0.4V: ADC (U2.3 U2.5 U3.3 U3.5), PWR_SRC (C21.1 U4.1 U4.5)
+3.3V_STM32: STM32_MCU (24 pins), PWR_SRC (6 pins)
+AVCC: ADC (U2.8 U3.8), PWR_SRC (AMS2.2 C20.1 C22.1 U4.4)
+V_Driver: Driver (5 pins), PWR_SRC (AMS3.2 C24.1)
GND: Driver (8 pins), STM32_MCU (30 pins), ADC (ADC1.1 U2.4 U3.4), PWR_SRC (24 pins)
PA2: STM32_MCU (U1.16), ADC (C14.1 R9.2 U3.1)
PA3: STM32_MCU (U1.17), ADC (C16.1 R11.2 U3.7)
PC2: STM32_MCU (U1.10), ADC (C13.1 R8.2 U2.1)
PC3: STM32_MCU (U1.11), ADC (C15.1 R10.2 U2.7)
PC10: Driver (JP2.2), STM32_MCU (U1.51)
PC11: Driver (JP3.2), STM32_MCU (U1.52)
PC12: Driver (JP4.2), STM32_MCU (U1.53)
PD2: Driver (JP5.2), STM32_MCU (U1.54)
USB_N: STM32_MCU (U1.44), PWR_SRC (D3.2 J1.2)
USB_P: STM32_MCU (U1.45), PWR_SRC (D2.2 J1.3)